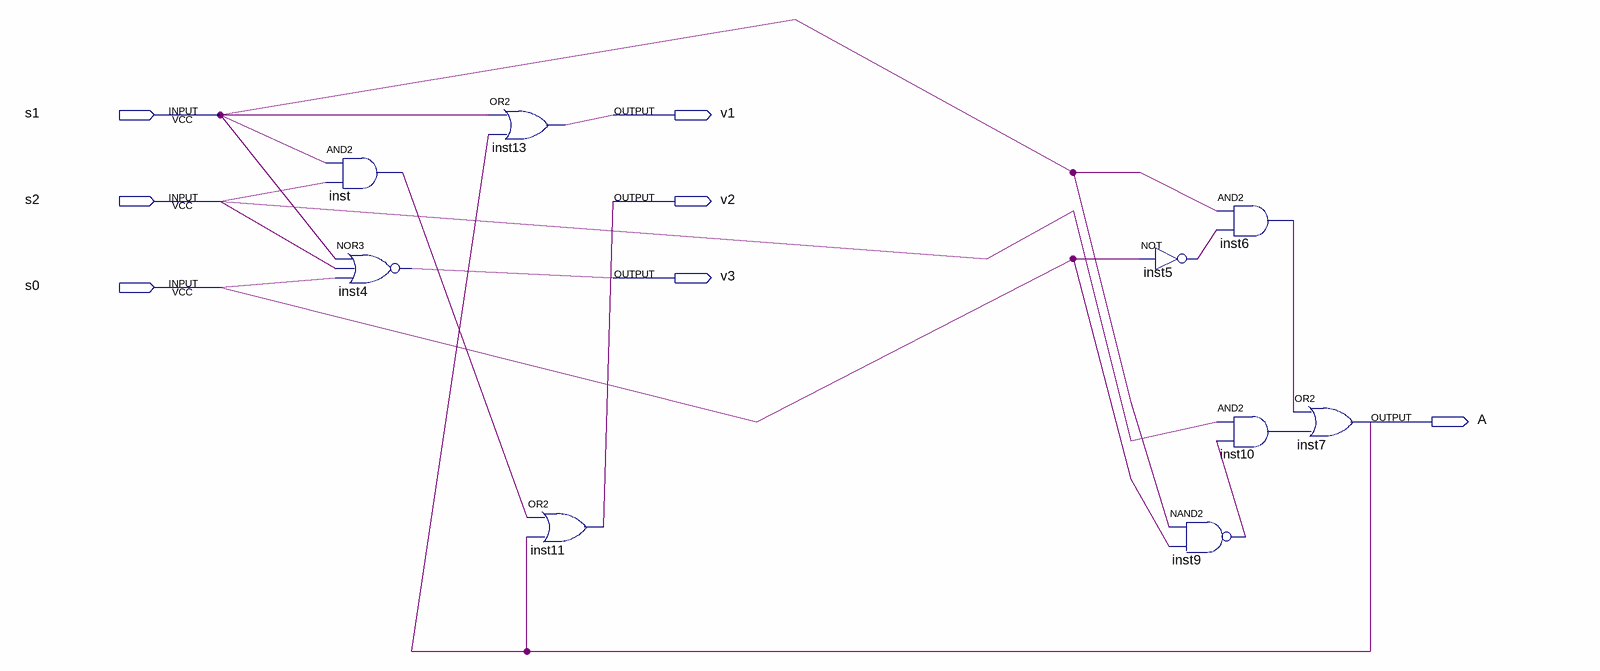
[diagram p0: schematic sheet]
// Quartus schematic aula02.bdf as structural Verilog: 9 symbols, 7 pins
module aula02 (
  input  s1,
  input  s2,
  input  s0,
  output v1,
  output v2,
  output v3,
  output A
);

  wire inst5_out, inst6_out, inst9_out, inst10_out, inst_out;

  and inst (inst_out, s1, s2);
  nor inst4 (v3, s1, s2, s0);
  or inst13 (v1, s1, A);
  or inst11 (v2, inst_out, A);
  not inst5 (inst5_out, s0);
  nand inst9 (inst9_out, s1, s0);
  and inst6 (inst6_out, s1, inst5_out);
  and inst10 (inst10_out, s2, inst9_out);
  or inst7 (A, inst6_out, inst10_out);
endmodule
